# Altium project QUTMS-BMS-TEMPSTRIP-LEFT-V00.PrjPcb
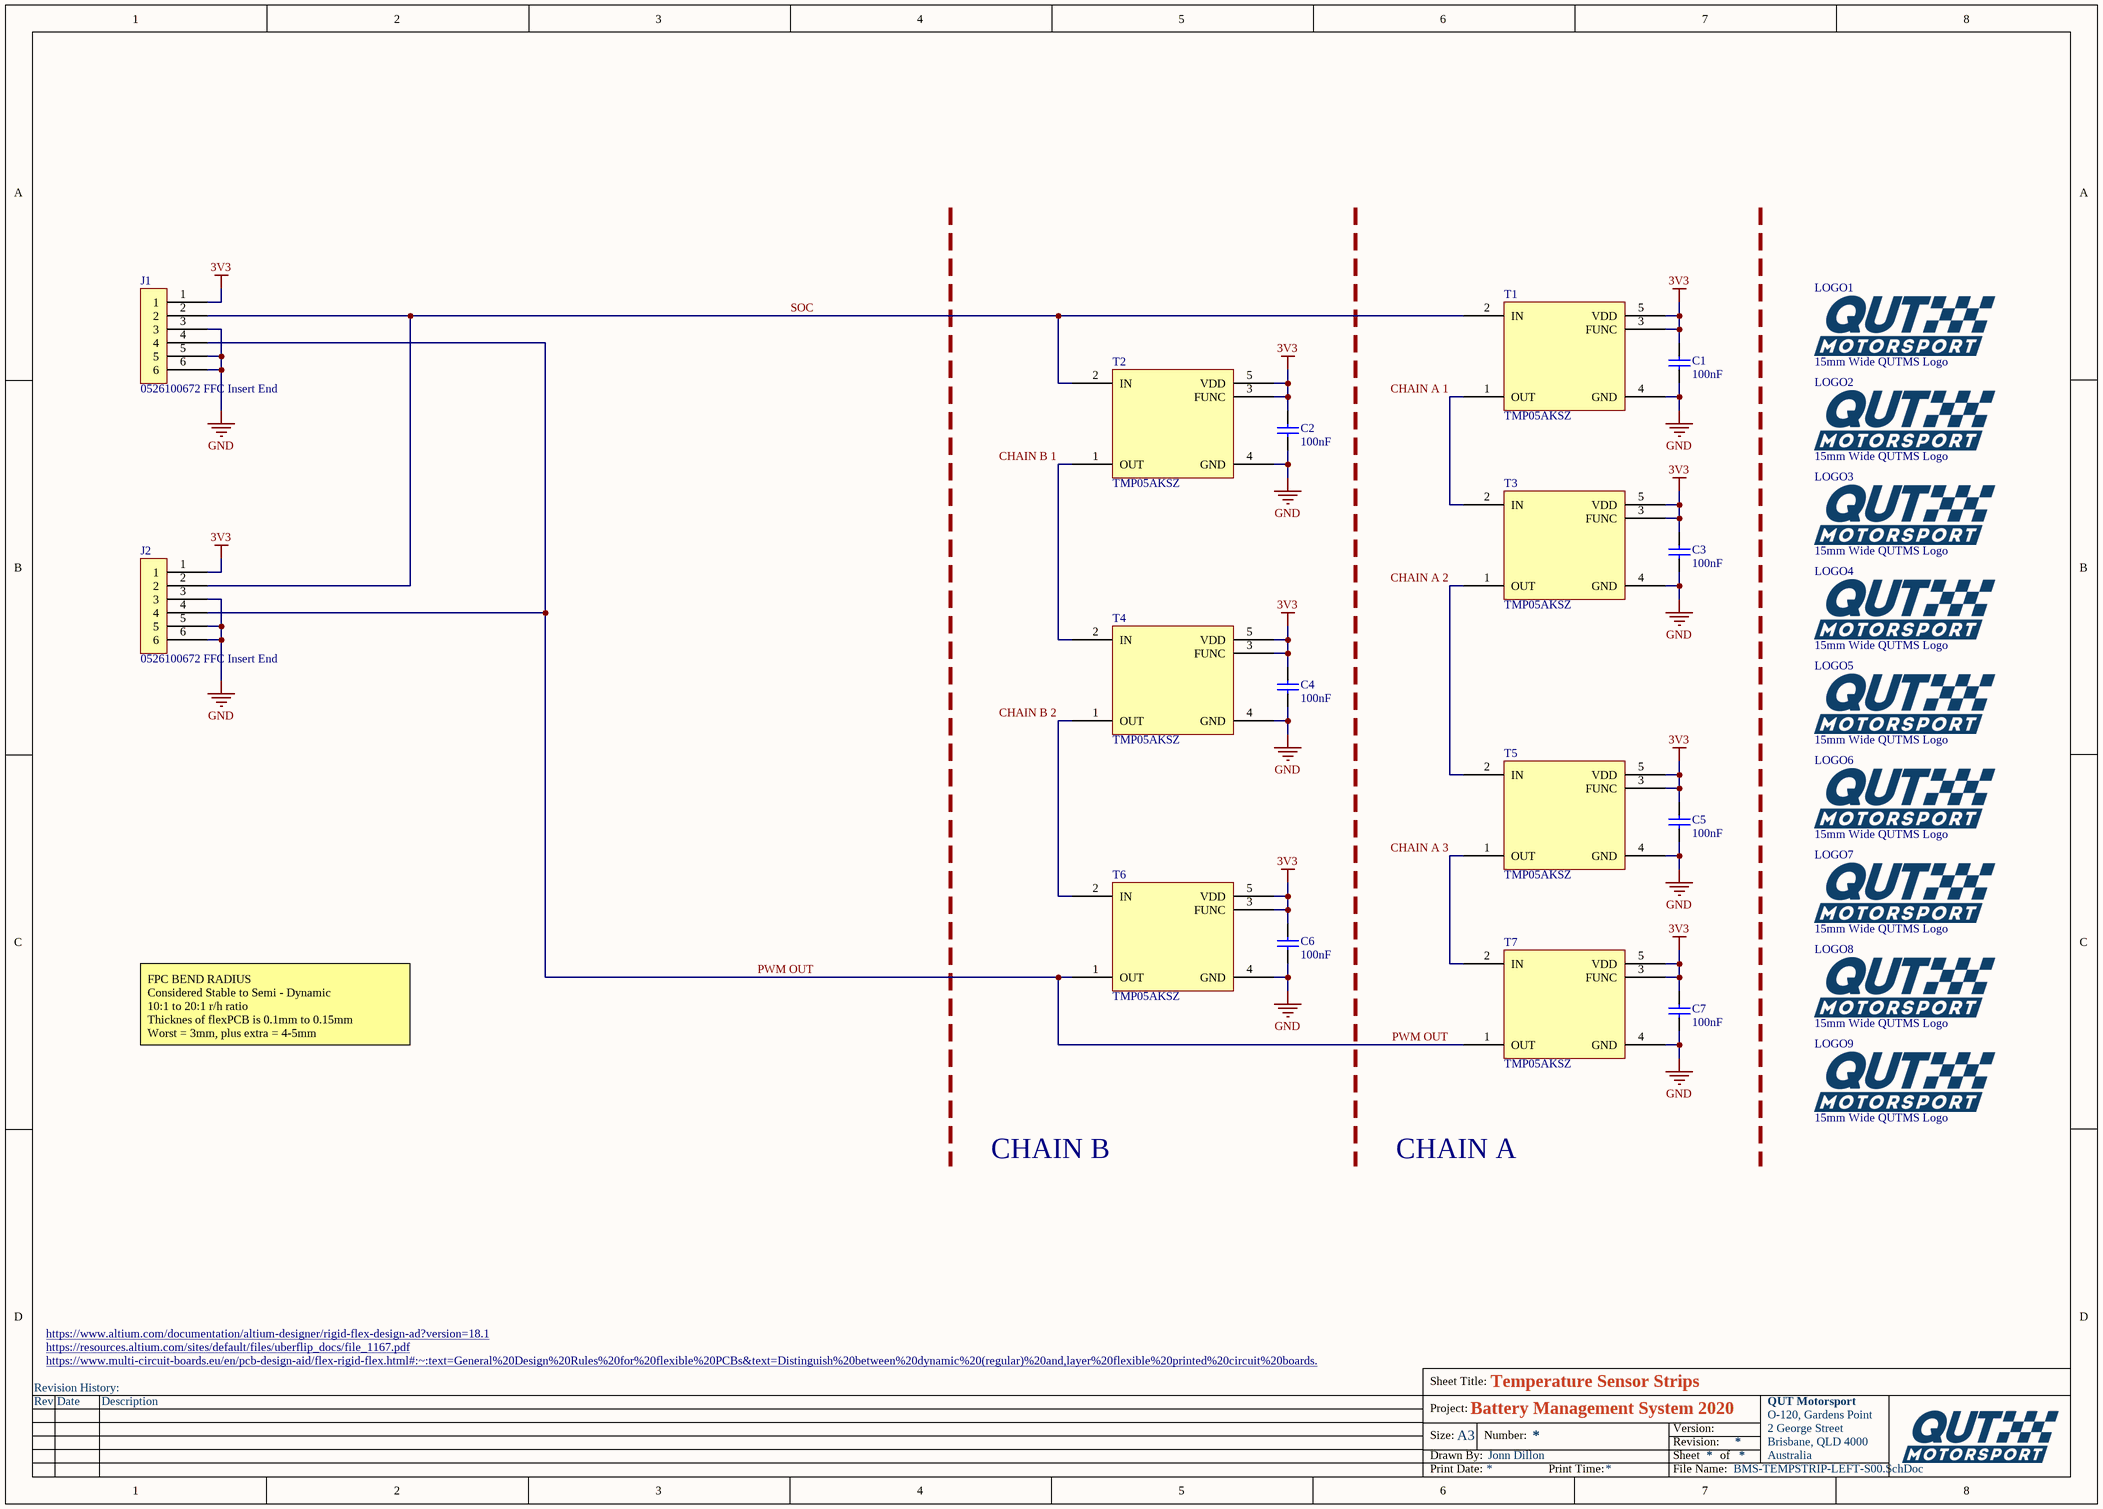
[diagram p0: BMS-TEMPSTRIP-LEFT-S00.SchDoc]
1 sheet, 25 parts. Net scope: global (net labels, ports and power ports of the same name join across sheets).
Board file: BMS-TEMPSTRIP-LEFT-P00.PcbDoc

## Sheet BMS-TEMPSTRIP-LEFT-S00.SchDoc: Temperature Sensor Strips
size A3; DrawnBy: Jonn Dillon; Project: Battery Management System 2020

### Parts
C1  100nF  [Cap_Ceramic_0603]
C2  100nF  [Cap_Ceramic_0603]
C3  100nF  [Cap_Ceramic_0603]
C4  100nF  [Cap_Ceramic_0603]
C5  100nF  [Cap_Ceramic_0603]
C6  100nF  [Cap_Ceramic_0603]
C7  100nF  [Cap_Ceramic_0603]
J1  0526100672 FFC Insert End  [0526100672 FFC Insert End]
J2  0526100672 FFC Insert End  [0526100672 FFC Insert End]
LOGO1  15mm Wide QUTMS Logo  [QUTMS LOGO 15MM]
LOGO2  15mm Wide QUTMS Logo  [QUTMS LOGO 15MM]
LOGO3  15mm Wide QUTMS Logo  [QUTMS LOGO 15MM]
LOGO4  15mm Wide QUTMS Logo  [QUTMS LOGO 15MM]
LOGO5  15mm Wide QUTMS Logo  [QUTMS LOGO 15MM]
LOGO6  15mm Wide QUTMS Logo  [QUTMS LOGO 15MM]
LOGO7  15mm Wide QUTMS Logo  [QUTMS LOGO 15MM]
LOGO8  15mm Wide QUTMS Logo  [QUTMS LOGO 15MM]
LOGO9  15mm Wide QUTMS Logo  [QUTMS LOGO 15MM]
T1  TMP05AKSZ  [SC-70 (KS-5)]
T2  TMP05AKSZ  [SC-70 (KS-5)]
T3  TMP05AKSZ  [SC-70 (KS-5)]
T4  TMP05AKSZ  [SC-70 (KS-5)]
T5  TMP05AKSZ  [SC-70 (KS-5)]
T6  TMP05AKSZ  [SC-70 (KS-5)]
T7  TMP05AKSZ  [SC-70 (KS-5)]

### Nets
3V3: C1.1 C2.1 C3.1 C4.1 C5.1 C6.1 C7.1 J1.1 J2.1 T1.3(FUNC) T1.5(VDD) T2.3(FUNC) T2.5(VDD) T3.3(FUNC) T3.5(VDD) T4.3(FUNC) T4.5(VDD) T5.3(FUNC) T5.5(VDD) T6.3(FUNC) T6.5(VDD) T7.3(FUNC) T7.5(VDD)
GND: C1.2 C2.2 C3.2 C4.2 C5.2 C6.2 C7.2 J1.3 J1.5 J1.6 J2.3 J2.5 J2.6 T1.4(GND) T2.4(GND) T3.4(GND) T4.4(GND) T5.4(GND) T6.4(GND) T7.4(GND)
CHAIN A 1: T1.1(OUT) T3.2(IN)
CHAIN A 2: T3.1(OUT) T5.2(IN)
CHAIN A 3: T5.1(OUT) T7.2(IN)
CHAIN B 1: T2.1(OUT) T4.2(IN)
CHAIN B 2: T4.1(OUT) T6.2(IN)
PWM OUT: J1.4 J2.4 T6.1(OUT) T7.1(OUT)
SOC: J1.2 J2.2 T1.2(IN) T2.2(IN)

### Notes on the sheet
- FPC BEND RADIUS
  Considered Stable to Semi - Dynamic
  10:1 to 20:1 r/h ratio
  Thicknes of flexPCB is 0.1mm to 0.15mm
  Worst = 3mm, plus extra = 4-5mm
- CHAIN B
- CHAIN A
- https://www.multi-circuit-boards.eu/en/pcb-design-aid/flex-rigid-flex.html#:~:text=General%20Design%20Rules%20for%20flexible%20PCBs&text=Distinguish%20between%20dynamic%20(regular)%20and,layer%20flexible%20printed%20circuit%20boards.
- https://resources.altium.com/sites/default/files/uberflip_docs/file_1167.pdf
- https://www.altium.com/documentation/altium-designer/rigid-flex-design-ad?version=18.1
- Revision History:
- Sheet Title:
- Rev
- Date
- Description
- Project:
- Size:
- Drawn By:
- A3
- Number:
- Revision:
- Sheet
- Version:
- of
- QUT Motorsport
- O-120, Gardens Point
- 2 George Street
- Brisbane, QLD 4000
- Australia
- Print Date:
- Print Time:
- File Name:

### Library data of the parts
C1-C7 = 100nF 50V 5% X7R 0603: Capacitor, Ceramic, SMD, 100nF, 50V, 5%, X7R, 0603
LOGO1-LOGO9 = QUTMS Logo 15mm
T1-T7 = TMP05AKSZ: Temperature Sensor, SMD, 3.3V, 2%, SOT-353